# Altium schematic sheet POWER.SchDoc
size A4
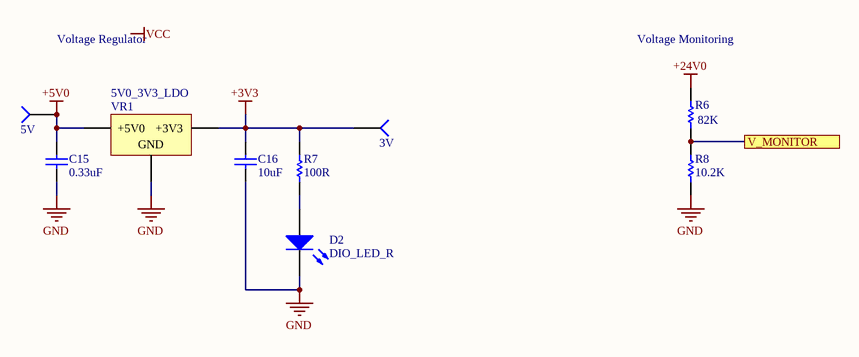
[diagram p0: POWER.SchDoc]

## Parts
2  5V  [TESTPOINT]
C15  value 0.33uF  [CAPC0603(1608)55_N]  (hidden comment: CAP_0.33uF_16V_0603)
C16  value 10uF  [CAPC0603(1608)55_N]  (hidden comment: CAP_10uF_0603)
D2  DIO_LED_R  [LED_0805_LINE]
R6  value 82K  [RESC0603(1608)_N]  (hidden comment: RES_82K_0603)
R7  value 100R  [RESC0603(1608)_N]  (hidden comment: RES_100R_0603)
R8  value 10.2K  [RESC0603(1608)_N]  (hidden comment: RES_10.2K_0603)
TP6  3V  [TESTPOINT]
VR1  5V0_3V3_LDO  [VOLTAGE_REGULATOR]

## Ports
V_MONITOR

## Nets
+3V3: C16.2 R7.2 TP6.1(=value) VR1.4(+3V3)
+5V0: 2.1(=value) C15.2 VR1.3(+5V0)
+24V0: R6.2
GND: C15.1 C16.1 D2.2(K) R8.1 VR1.1(GND)
V_MONITOR: R6.1 R8.2 ; port V_MONITOR
NetD2_1: D2.1(A) R7.1

## Notes on the sheet
- Voltage Regulator
- Voltage Monitoring
- Labels drawn without touching a wire or pin: VCC

## Library data of the parts
2 TP6 = TESTPOINT_SMD: Part Number (MPN): *
C15 = CAP_0.33uF_16V_0603: CAP CER 0.33UF 16V X7R 0603; Part Number: GRM188R71C334KA01D; Manufacturer: Murata Electronics North America; Dimensions: 0.063" L x 0.031" W (1.60mm x 0.80mm); Package: 0603 (1608 Metric); Temperature Coefficient: X7R; Voltage Rating: 16V
C16 = CAP_10uF_0603: CAP CER 10UF 10V X5R 0603; Part Number: CC0603MRX5R6BB106; Manufacturer: Yageo; Dimensions: 0.063" L x 0.031" W (1.60mm x 0.80mm); Package: 0603 (1608 Metric); Temperature Coefficient: X5R; Voltage Rating: 10V
D2 = DIO_LED_R: LED RED DIFFUSED 0805 SMD; Part Number: LS R976-NR-1; Manufacturer: OSRAM; Forward Voltage Drop: 2V; Package: 0805 (2012 Metric)
R6 = RES_634K_0603: RES SMD 82K OHM 1% 1/10W 0603; Manufacturer: Yageo; Part Number (MPN): RC0603FR-07634KL; Package: 0603 (1608 Metric); Dimensions: 0.063" L x 0.031" W (1.60mm x 0.80mm); Tolerance: 1%; Digikey Part Number: 311-634KHRCT-ND
R7 = RES_100R_0603: RES SMD 100 OHM 1% 1/10W 0603; Manufacturer: Yageo; Part Number (MPN): RC0603FR-07100RL; Package: 0603 (1608 Metric); Dimensions: 0.063" L x 0.031" W (1.60mm x 0.80mm); Tolerance: 1%
R8 = RES_100K_0603: RES SMD 10.2K OHM 5% 1/10W 0603; Manufacturer: Yageo; Part Number (MPN): RC0603FR-07261KL; Package: 0603 (1608 Metric); Dimensions: 0.063" L x 0.031" W (1.60mm x 0.80mm); Tolerance: 5%; Digikey Part Number: 311-261KHRCT-ND
VR1 = 5V0_3V3_LDO: IC REG LINEAR 3.3V 1A DPAK; Part Number: NCP1117DT33T5G; Manufacturer: ON Semiconductor; Current Output: 1A